# EAGLE schematic Homework_1 by Jonathan Pilling (EAGLE 9.2.2)
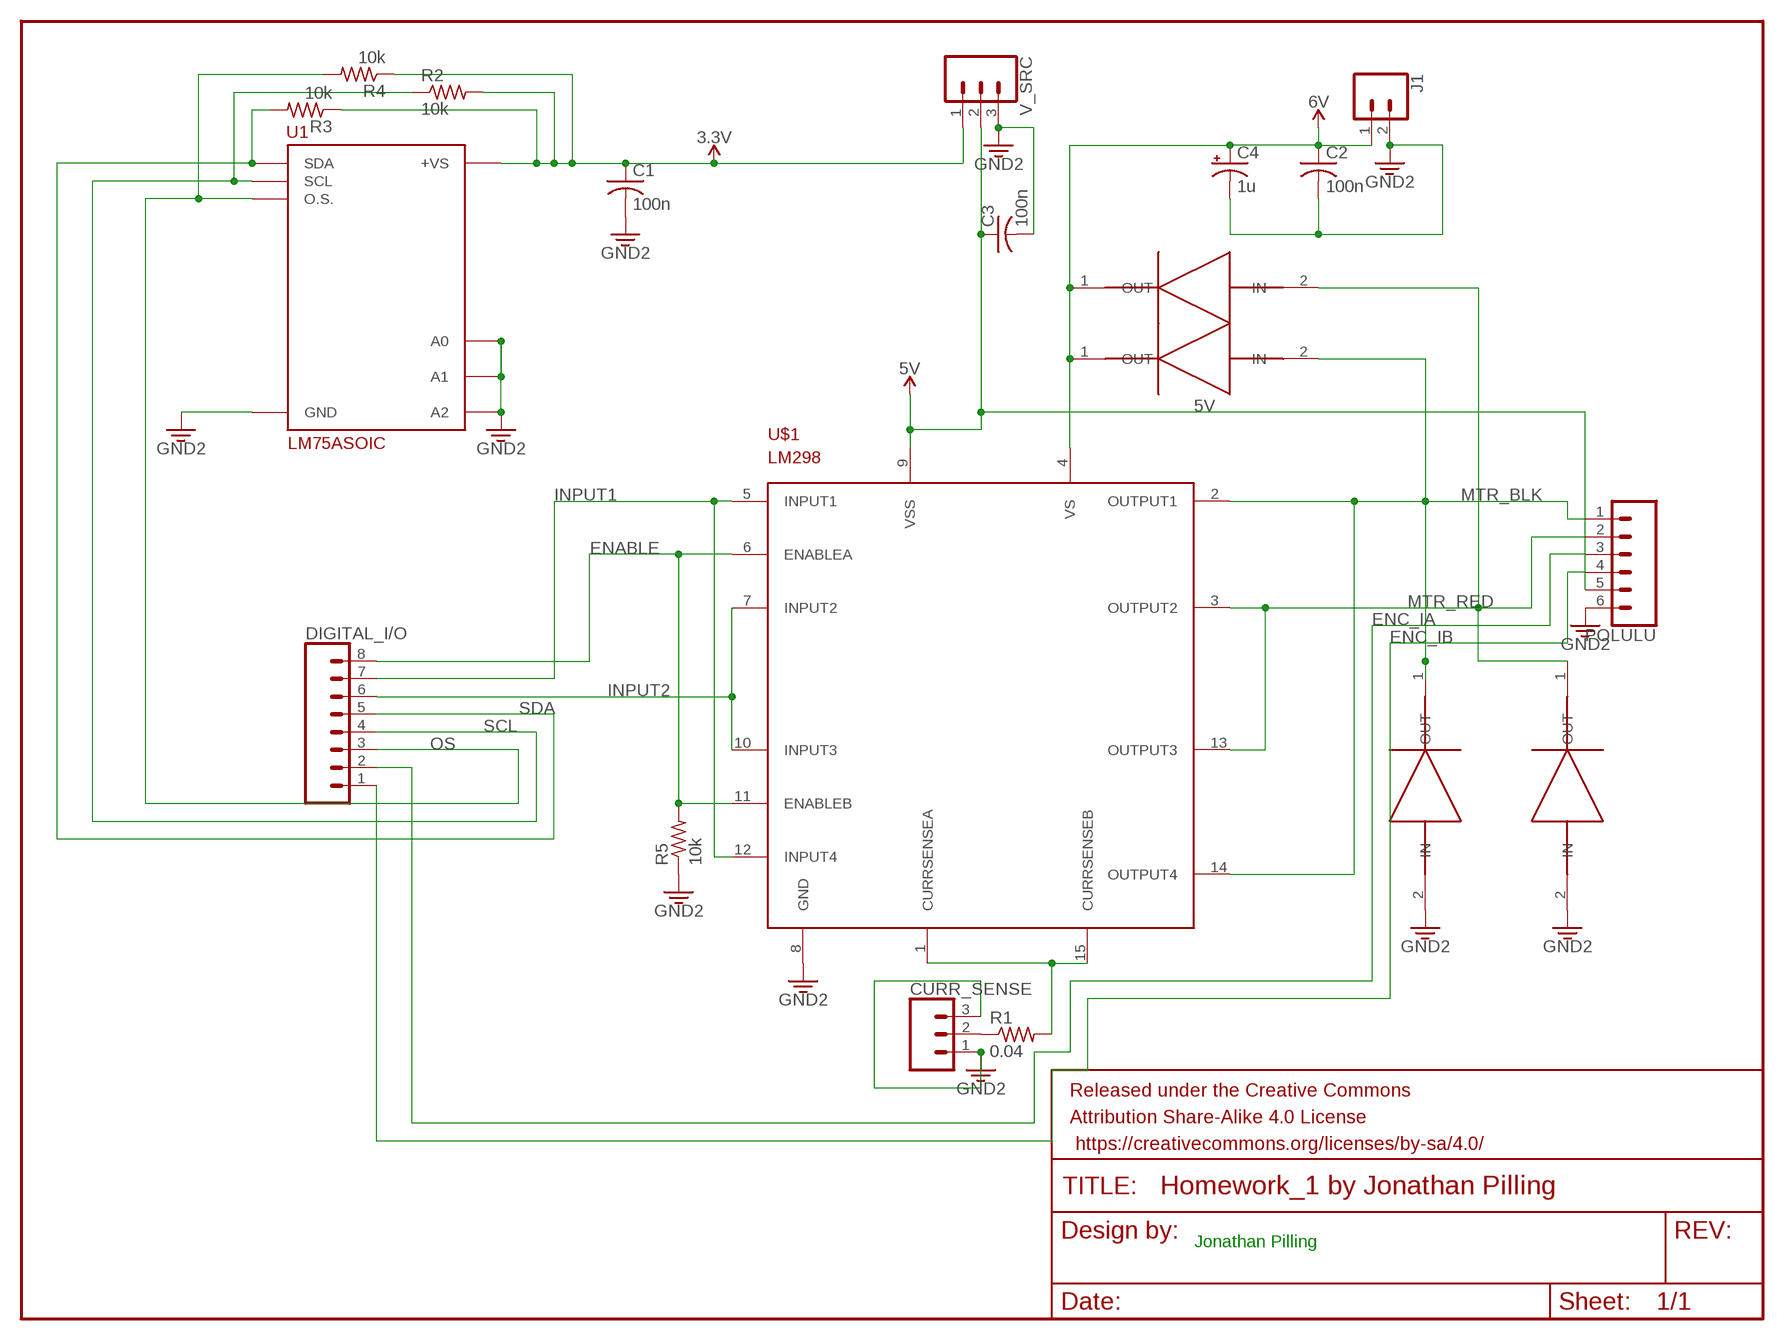
[diagram p0: schematic, sheet 1]

## Parts
C1  100n  C-USC1206  [C1206]
C2  100n  C-USC1206  [C1206]
C3  100n  C-USC1206  [C1206]
C4  1u  CPOL-USE2.5-5  [E2,5-5]
CURR_SENSE  CONN_03  [1X03]
D2  SURFACE_MOUNT_DIODE  [SURFACE_MOUNT_DIODE]
DIGITAL_I/O  CONN_08"  [1X08]
J1  CONN_025MM  [SCREWTERMINAL-5MM-2]
JONATHAN_PILLING  Frame  FRAME-LETTERNO_PACKAGE  [DUMMY]
POLULU  CONN_06SILK_FEMALE_PTH  [1X06]
R1  0.04  R-US_M1206  [M1206]
R2  10k  R-US_M1206  [M1206]
R3  10k  R-US_R1206  [R1206]
R4  10k  R-US_R1206  [R1206]
R5  10k  R-US_M1206  [M1206]
U1  LM75ASOIC  [LM75A]
U$1  LM298  [LM298]
U$2  SURFACE_MOUNT_DIODE  [SURFACE_MOUNT_DIODE]
U$4  SURFACE_MOUNT_DIODE  [SURFACE_MOUNT_DIODE]
U$5  SURFACE_MOUNT_DIODE  [SURFACE_MOUNT_DIODE]
V_SRC  CONN_03  [1X03]

## Nets
3.3V: C1.1 C1.2 C2.2 C3.2 C4.- CURR_SENSE.1 CURR_SENSE.3 D2.2(IN) J1.2 POLULU.6 R2.2 R3.1 R4.1 R5.1 U1.4(GND) U1.5(A2) U1.6(A1) U1.7(A0) U1.8(+VS) U$1.8(GND) U$2.2(IN) V_SRC.1 V_SRC.3 ; supply symbol labelled GND2
5V: C3.1 POLULU.5 U$1.9(VSS) V_SRC.2
ENABLE: DIGITAL_I/O.8 R5.2 U$1.6(ENABLEA) U$1.11(ENABLEB)
ENC_IA: DIGITAL_I/O.2 POLULU.3
ENC_IB: DIGITAL_I/O.1 POLULU.4
INPUT1: DIGITAL_I/O.7 U$1.5(INPUT1) U$1.12(INPUT4)
INPUT2: DIGITAL_I/O.6 U$1.7(INPUT2) U$1.10(INPUT3)
MTR_BLK: D2.1(OUT) POLULU.1 U$1.2(OUTPUT1) U$1.14(OUTPUT4) U$5.2(IN)
MTR_RED: POLULU.2 U$1.3(OUTPUT2) U$1.13(OUTPUT3) U$2.1(OUT) U$4.2(IN)
N$8: CURR_SENSE.2 R1.1
N$9: R1.2 U$1.1(CURRSENSEA) U$1.15(CURRSENSEB)
OS: DIGITAL_I/O.3 R4.2 U1.3(O.S.)
SCL: DIGITAL_I/O.4 R2.1 U1.2(SCL)
SDA: DIGITAL_I/O.5 R3.2 U1.1(SDA)
VCC: C2.1 C4.+ J1.1 U$1.4(VS) U$4.1(OUT) U$5.1(OUT) ; supply symbol labelled 6V

## Notes on the sheet
- Jonathan Pilling

## Library data of the parts
C1-C3 = rcl:C-US: CAPACITOR, American symbol; SPICEPREFIX: C
C4 = rcl:CPOL-US: POLARIZED CAPACITOR, American symbol; SPICEPREFIX: C
CURR_SENSE V_SRC = SparkFun-Connectors:CONN_03: Multi connection point. Often used as Generic Header-pin footprint for 0.1 inch spaced/style header connections On any of the 0.1 inch spaced packages, you can populate with these: Break Away Headers - Straight <https://www.sparkfun.com/products/116> (PRT-00116) Break Away Male Headers - Right Angle <https://www.sparkfun.com/products/553> (PRT-00553) Female Headers <https://www.sparkfun.com/products/115> (PRT-00115) Break Away Headers - Machine Pin <https://www.sparkfun.com/products/117> (PRT-00117) Break Away Female Headers - Swiss Machine Pin <https://www.sparkfun.com/products/743> (PRT-00743) Stackable Header - 3 Pin (Female, 0.1") <https://www.sparkfun.com/products/13875> (PRT-13875) For SCREWTERMINALS and SPRING TERMINALS visit here: Screw Terimnals on SparkFun.com <https://www.sparkfun.com/search/results?term=Screw+Terminals> (5mm/3.5mm/2.54mm spacing) This device is also useful as a general connection point to wire up your design to another part of your project. Our various solder wires solder well into these plated through hole pads. Hook-Up Wire - Assortment (Stranded, 22 AWG) <https://www.sparkfun.com/products/11375> (PRT-11375) Hook-Up Wire - Assortment (Solid Core, 22 AWG) <https://www.sparkfun.com/products/11367> (PRT-11367) View the entire wire category on our website here <https://www.sparkfun.com/categories/141> Special notes: Molex polarized connector foot print use with SKU : PRT-08232 with associated crimp pins and housings.
D2 U$2 U$4 U$5 = Jons_lib:SURFACE_MOUNT_DIODE
DIGITAL_I/O = SparkFun-Connectors:CONN_08: Multi connection point. Often used as Generic Header-pin footprint for 0.1 inch spaced/style header connections On any of the 0.1 inch spaced packages, you can populate with these: Break Away Headers - Straight <https://www.sparkfun.com/products/116> (PRT-00116) Break Away Male Headers - Right Angle <https://www.sparkfun.com/products/553> (PRT-00553) Female Headers <https://www.sparkfun.com/products/115> (PRT-00115) Break Away Headers - Machine Pin <https://www.sparkfun.com/products/117> (PRT-00117) Break Away Female Headers - Swiss Machine Pin <https://www.sparkfun.com/products/743> (PRT-00743) Arduino Stackable Header - 8 Pin <https://www.sparkfun.com/products/9279> (PRT-09279) For SCREWTERMINALS and SPRING TERMINALS visit here: Screw Terimnals on SparkFun.com <https://www.sparkfun.com/search/results?term=Screw+Terminals> (5mm/3.5mm/2.54mm spacing) This device is also useful as a general connection point to wire up your design to another part of your project. Our various solder wires solder well into these plated through hole pads. Hook-Up Wire - Assortment (Stranded, 22 AWG) <https://www.sparkfun.com/products/11375> (PRT-11375) Hook-Up Wire - Assortment (Solid Core, 22 AWG) <https://www.sparkfun.com/products/11367> (PRT-11367) View the entire wire category on our website here <https://www.sparkfun.com/categories/141> Special notes: Molex polarized connector foot print use with SKU : PRT-08231 with associated crimp pins and housings. 1MM SMD Version SKU: PRT-10208 NOTES ON THE VARIANTS LOCK and LOCK_LONGPADS... This footprint was designed to help hold the alignment of a through-hole component (i.e. 6-pin header) while soldering it into place. You may notice that each hole has been shifted either up or down by 0.005 of an inch from it's more standard position (which is a perfectly straight line). This slight alteration caused the pins (the squares in the middle) to touch the edges of the holes. Because they are alternating, it causes a "brace" to hold the component in place. 0.005 has proven to be the perfect amount of "off-center" position when using our standard breakaway headers. Although looks a little odd when you look at the bare footprint, once you have a header in there, the alteration is very hard to notice. Also,if you push a header all the way into place, it is covered up entirely on the bottom side.; PROD_ID: CONN-08438
J1 = SparkFun-Connectors:CONN_02: Multi connection point. Often used as Generic Header-pin footprint for 0.1 inch spaced/style header connections On any of the 0.1 inch spaced packages, you can populate with these: Break Away Headers - Straight <https://www.sparkfun.com/products/116> (PRT-00116) Break Away Male Headers - Right Angle <https://www.sparkfun.com/products/553> (PRT-00553) Female Headers <https://www.sparkfun.com/products/115> (PRT-00115) Break Away Headers - Machine Pin <https://www.sparkfun.com/products/117> (PRT-00117) Break Away Female Headers - Swiss Machine Pin <https://www.sparkfun.com/products/743> (PRT-00743) For SCREWTERMINALS and SPRING TERMINALS visit here: Screw Terimnals on SparkFun.com <https://www.sparkfun.com/search/results?term=Screw+Terminals> (5mm/3.5mm/2.54mm spacing) This device is also useful as a general connection point to wire up your design to another part of your project. Our various solder wires solder well into these plated through hole pads. Hook-Up Wire - Assortment (Stranded, 22 AWG) <https://www.sparkfun.com/products/11375> (PRT-11375) Hook-Up Wire - Assortment (Solid Core, 22 AWG) <https://www.sparkfun.com/products/11367> (PRT-11367) View the entire wire category on our website here <https://www.sparkfun.com/categories/141> Special notes: Molex polarized connector foot print use with: PRT-08233 with associated crimp pins and housings. 2.54_SCREWTERM for use with PRT-10571. 3.5mm Screw Terminal footprints for PRT-08084 5mm Screw Terminal footprints for use with PRT-08432; SF_SKU: PRT-08432
JONATHAN_PILLING = SparkFun-Aesthetics:FRAME-LETTER: Schematic Frame - Letter Standard 8.5x11 US Letter frame; DESIGNER: Jonathan Pilling; VERSION: v01
POLULU = SparkFun-Connectors:CONN_06: Multi connection point. Often used as Generic Header-pin footprint for 0.1 inch spaced/style header connections On any of the 0.1 inch spaced packages, you can populate with these: Break Away Headers - Straight <https://www.sparkfun.com/products/116> (PRT-00116) Break Away Male Headers - Right Angle <https://www.sparkfun.com/products/553> (PRT-00553) Female Headers <https://www.sparkfun.com/products/115> (PRT-00115) Break Away Headers - Machine Pin <https://www.sparkfun.com/products/117> (PRT-00117) Break Away Female Headers - Swiss Machine Pin <https://www.sparkfun.com/products/743> (PRT-00743) Arduino Stackable Header - 6 Pin <https://www.sparkfun.com/products/9280> (PRT-09280) For SCREWTERMINALS and SPRING TERMINALS visit here: Screw Terimnals on SparkFun.com <https://www.sparkfun.com/search/results?term=Screw+Terminals> (5mm/3.5mm/2.54mm spacing) This device is also useful as a general connection point to wire up your design to another part of your project. Our various solder wires solder well into these plated through hole pads. Hook-Up Wire - Assortment (Stranded, 22 AWG) <https://www.sparkfun.com/products/11375> (PRT-11375) Hook-Up Wire - Assortment (Solid Core, 22 AWG) <https://www.sparkfun.com/products/11367> (PRT-11367) View the entire wire category on our website here <https://www.sparkfun.com/categories/141>; PROD_ID: CONN-08437
R1-R5 = rcl:R-US_: RESISTOR, American symbol; SPICEPREFIX: R
U1 = Jons_lib:LM75A: The LM75A is an industry-standard digital temperature sensor with an integrated sigma-delta analog-to-digital converter (ADC) and I2C interface. Provides 9-bit digital temperature readings.
U$1 = Jons_lib:LM298: H Bridge Component LM298